# Altium schematic sheet full-bridge-driver.SchDoc
size A2
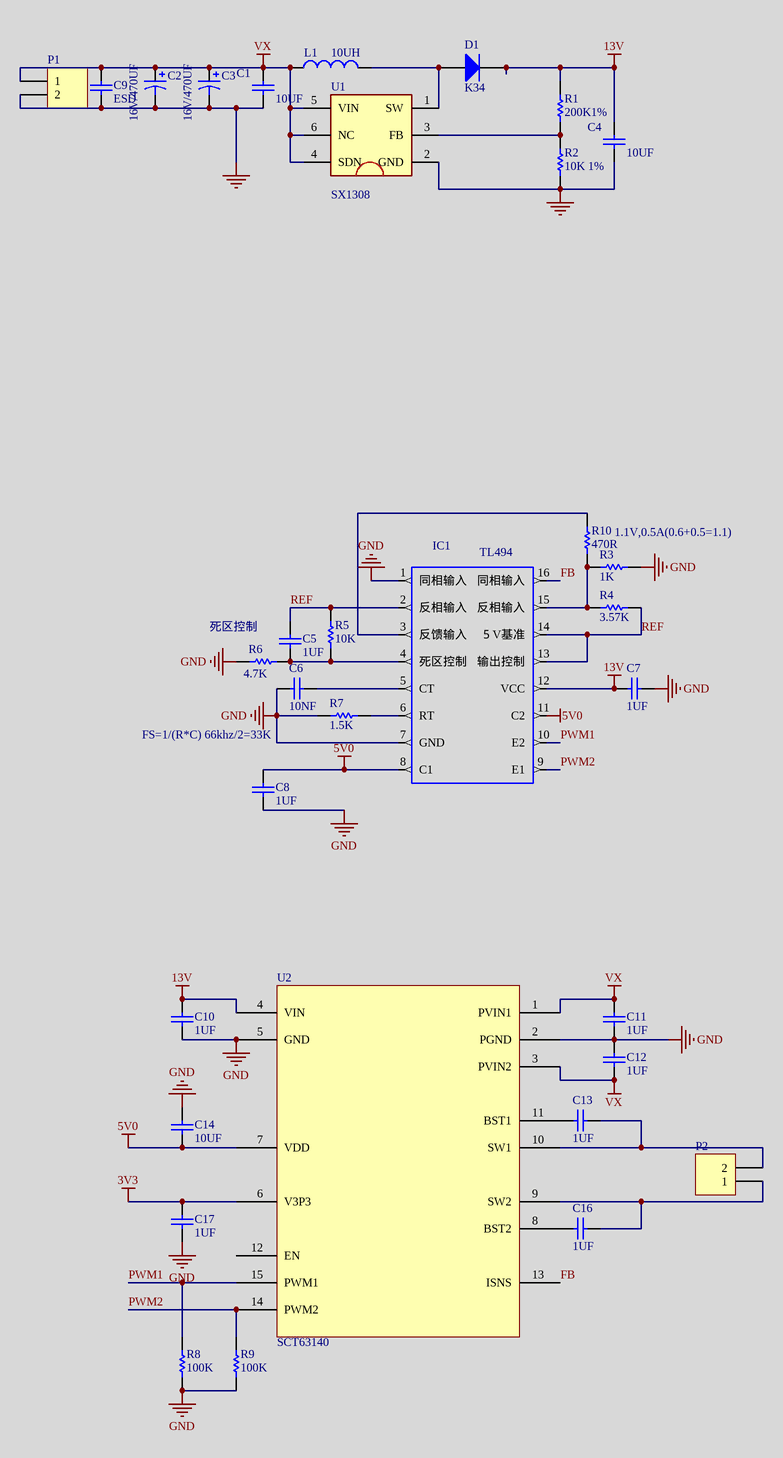
[diagram p0: full-bridge-driver.SchDoc]

## Parts
C1  10UF  [C1608-0603N]
C2  16V/470UF  [EC_8mm - 3.5MM]
C3  16V/470UF  [EC_8mm - 3.5MM]
C4  10UF  [C1608-0603N]
C5  1UF  [C1608-0603N]
C6  10NF  [C1608-0603N]
C7  1UF  [C1608-0603N]
C8  1UF  [C1608-0603N]
C9  ESD  [C1608-0603N]
C10  1UF  [C1608-0603N]
C11  1UF  [C1608-0603N]
C12  1UF  [C1608-0603N]
C13  1UF  [C1608-0603N]
C14  10UF  [C1608-0603N]
C16  1UF  [C1608-0603N]
C17  1UF  [C1608-0603N]
D1  K34  [DIODE_1206N]
IC1  TL494  [SOP16]
L1  10UH  [252010]
P1  (no value)  [XHB_2pin_2.54mm]
P2  (no value)  [XHB_2pin_2.54mm]
R1  200K1%  [C1608-0603N]
R2  10K 1%  [C1608-0603N]
R3  1K  [C1608-0603N]
R4  3.57K  [C1608-0603N]
R5  10K  [C1608-0603N]
R6  4.7K  [C1608-0603N]
R7  1.5K  [C1608-0603N]
R8  100K  [C1608-0603N]
R9  100K  [C1608-0603N]
R10  470R  [C1608-0603N]
U1  SX1308  [SOT23-6]
U2  SCT63140  [FCQFN-15L]

## Nets
3V3: C17.2 U2.6(V3P3)
5V0: C8.2 C14.2 IC1.8(C1) IC1.11(C2) U2.7(VDD)
13V: C4.1 C7.1 C10.2 D1.2(K) IC1.12(VCC) R1.1 U2.4(VIN)
GND: C1.2 C2.2 C3.2 C4.2 C6.1 C7.2 C8.1 C9.2 C10.1 C11.1 C12.2 C14.1 C17.1 IC1.1(同相输入) IC1.7(GND) P1.2 R2.2 R3.1 R6.1 R7.1 R8.2 R9.2 U1.2(GND) U2.2(PGND) U2.5(GND)
VX: C1.1 C2.1 C3.1 C9.1 C11.2 C12.1 L1.1 P1.1 U1.4(SDN) U1.5(VIN) U1.6(NC) U2.1(PVIN1) U2.3(PVIN2)
FB: IC1.16(同相输入) U2.13(ISNS)
PWM1: IC1.10(E2) R8.1 U2.15(PWM1)
PWM2: IC1.9(E1) R9.1 U2.14(PWM2)
REF: C5.2 IC1.2(反相输入) IC1.13(输出控制) IC1.14(５V基准) R4.1 R5.2
NetC5_1: C5.1 IC1.4(死区控制) R5.1 R6.2
NetC6_2: C6.2 IC1.5(CT)
NetC13_1: C13.1 P2.2 U2.10(SW1)
NetC13_2: C13.2 U2.11(BST1)
NetC16_1: C16.1 P2.1 U2.9(SW2)
NetC16_2: C16.2 U2.8(BST2)
NetD1_1: D1.1(A) L1.2 U1.1(SW)
NetIC1_3: IC1.3(反馈输入) R10.1
NetIC1_6: IC1.6(RT) R7.2
NetIC1_15: IC1.15(反相输入) R3.2 R4.2 R10.2
NetR1_2: R1.2 R2.1 U1.3(FB)

Not connected (* = marked no-connect by the designer): U2 12(EN)

## Notes on the sheet
- 1.1V,0.5A(0.6+0.5=1.1)
- (near R6) 死区控制
- FS=1/(R*C) 66khz/2=33K

## Library data of the parts
C1 C4-C8 C10-C14 C16 C17 = Cap: Capacitor; Manufacturer: Generic Components; Class: Passive; Published: 08/06/2000; Publisher: Altium Hobart Technology Centre; SubClass: Capacitor
C2 C3 = Cap Pol3: Polarized Capacitor (Surface Mount); Value: 100pF; Published: 8-Jun-2000; LatestRevisionDate: 29-May-2009; LatestRevisionNote: IPC-7351 Footprint Added.; PackageReference: C0805; Publisher: Altium Limited; PackageDescription: Chip Capacitor
C9 = Cap: 压敏电阻; 封装: 0603; 编号: *; 品名规格: *; 类别: *
D1 = Diode: Default Diode; Manufacturer: Generic Components; Class: Discrete; SubClass: Diode - Switching; Published: 08/06/2000; Publisher: Altium Hobart Technology Centre
L1 = Inductor: Code_IEC: 1005; Published: 8-Jun-2000; LatestRevisionDate: 17-Jul-2002; LatestRevisionNote: Re-released for DXP Platform.; PackageReference: 0402-A; Publisher: Altium Limited; Code_JEITA: 0402
P1 P2 = Header 2: Header, 2-Pin; LatestRevisionDate: 17-Jul-2002; LatestRevisionNote: Re-released for DXP Platform.; Publisher: Altium Limited
R1-R10 = Res1: Resistor; Manufacturer: Generic Components; Class: Passive; Published: 08/06/2000; Publisher: Altium Hobart Technology Centre; SubClass: Resistor